# EAGLE schematic csa_copro-v1.0b (EAGLE 4.15)
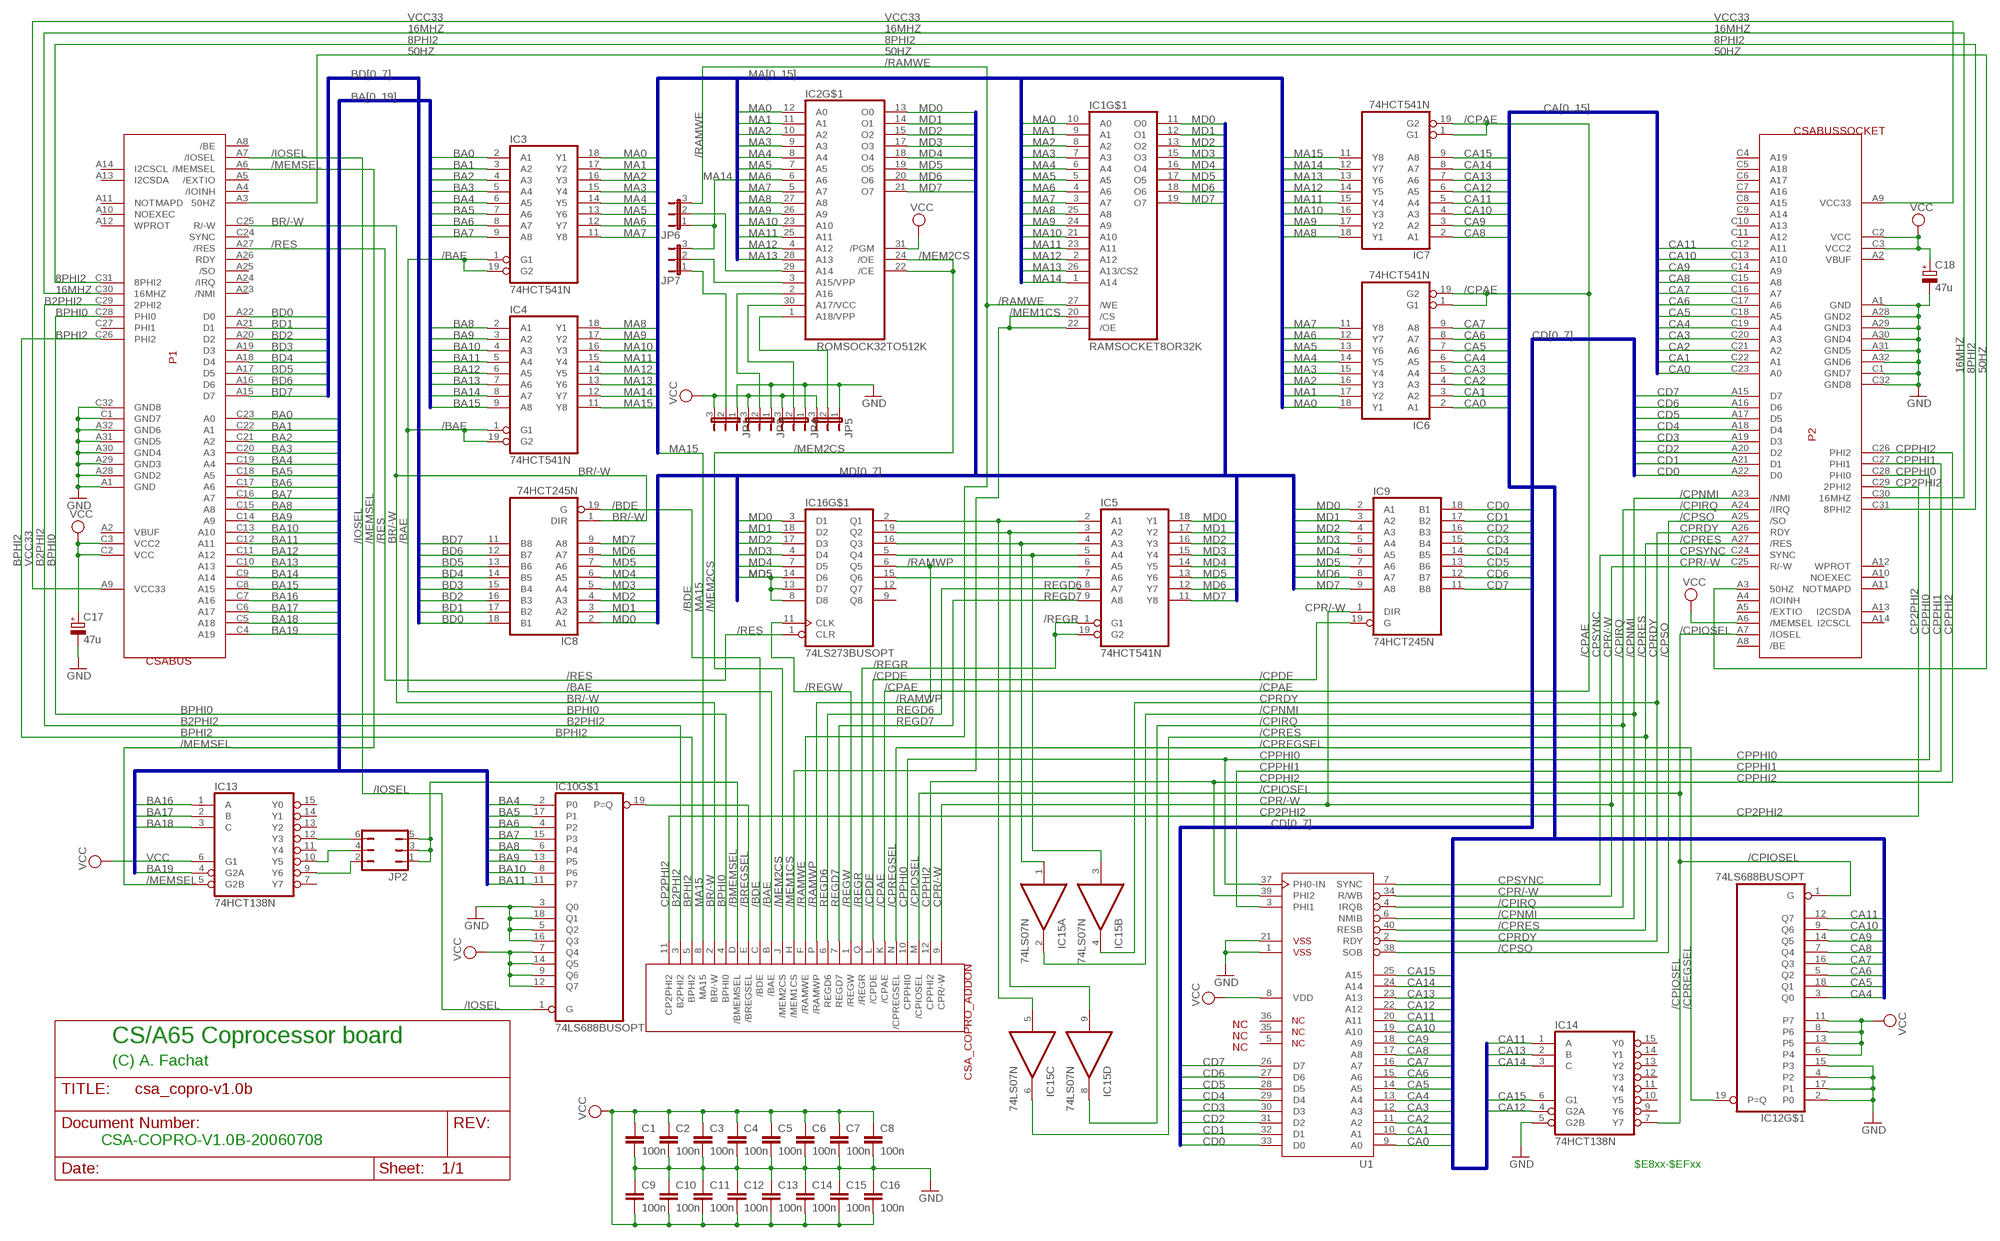
[diagram p0: schematic, sheet 1]

## Parts
C1  100n  C-EU025-025X050  [C025-025X050]
C2  100n  C-EU025-025X050  [C025-025X050]
C3  100n  C-EU025-025X050  [C025-025X050]
C4  100n  C-EU025-025X050  [C025-025X050]
C5  100n  C-EU025-025X050  [C025-025X050]
C6  100n  C-EU025-025X050  [C025-025X050]
C7  100n  C-EU025-025X050  [C025-025X050]
C8  100n  C-EU025-025X050  [C025-025X050]
C9  100n  C-EU025-025X050  [C025-025X050]
C10  100n  C-EU025-025X050  [C025-025X050]
C11  100n  C-EU025-025X050  [C025-025X050]
C12  100n  C-EU025-025X050  [C025-025X050]
C13  100n  C-EU025-025X050  [C025-025X050]
C14  100n  C-EU025-025X050  [C025-025X050]
C15  100n  C-EU025-025X050  [C025-025X050]
C16  100n  C-EU025-025X050  [C025-025X050]
C17  47u  CPOL-EUE2.5-5  [E2,5-5]
C18  47u  CPOL-EUE2.5-5  [E2,5-5]
IC1  RAMSOCKET8OR32K  [DIL28]
IC2  ROMSOCK32TO512K  [DIL32OPT28]
IC3  74HCT541N  [DIL20]
IC4  74HCT541N  [DIL20]
IC5  74HCT541N  [DIL20]
IC6  74HCT541N  [DIL20]
IC7  74HCT541N  [DIL20]
IC8  74HCT245N  [DIL20]
IC9  74HCT245N  [DIL20]
IC10  74LS688BUSOPT  [DIL20]
IC12  74LS688BUSOPT  [DIL20]
IC13  74HCT138N  [DIL16]
IC14  74HCT138N  [DIL16]
IC15  74LS07N  [DIL14]
IC16  74LS273BUSOPT  [DIL20]
JP1  JP2E  [JP2]
JP2  JP3Q  [JP3Q]
JP3  JP2E  [JP2]
JP4  JP2E  [JP2]
JP5  JP2E  [JP2]
JP6  JP2E  [JP2]
JP7  JP2E  [JP2]
P1  CSABUS  [CSABUS]
P2  CSABUSSOCKET  [CSABUSSOCK]
P3  CSA_COPRO_ADDON  [FLAT28]
U1  G65SC02P  [DIP-40]

## Nets
8PHI2: P1.C31(8PHI2) P2.C31(8PHI2)
16MHZ: P1.C30(16MHZ) P2.C30(16MHZ)
50HZ: P1.A3(50HZ) P2.A3(50HZ)
/BAE: IC3.1(G1) IC3.19(G2) IC4.1(G1) IC4.19(G2) P3.B(/BAE)
/BDE: IC8.19(G) P3.C(/BDE)
/BMEMSEL: JP2.1 JP2.3 JP2.5 P3.D(/BMEMSEL)
/BREGSEL: IC10.19(P=Q) P3.E(/BREGSEL)
/CPAE: IC6.1(G1) IC6.19(G2) IC7.1(G1) IC7.19(G2) P3.K(/CPAE)
/CPDE: IC9.19(G) P3.L(/CPDE)
/CPIOSEL: IC12.1(G) IC14.7(Y7) P2.A7(/IOSEL) P3.M(/CPIOSEL)
/CPIRQ: IC15.8(D:O) P2.A24(/IRQ) U1.4(IRQB)
/CPNMI: IC15.2(A:O) P2.A23(/NMI) U1.6(NMIB)
/CPREGSEL: IC12.19(P=Q) P3.N(/CPREGSEL)
/CPRES: IC15.6(C:O) P2.A27(/RES) U1.40(RESB)
/CPSO: P2.A25(/SO) U1.38(SOB)
/IOSEL: IC10.1(G) P1.A7(/IOSEL)
/MEM1CS: IC1.20(/CS) IC1.22(/OE) P3.H(/MEM1CS)
/MEM2CS: IC2.22(/CE) IC2.24(/OE) P3.J(/MEM2CS)
/MEMSEL: IC13.5(G2B) P1.A6(/MEMSEL)
/RAMWE: IC1.27(/WE) JP6.3 P3.F(/RAMWE)
/RAMWP: IC5.6(A5) IC16.6(Q5) P3.P(/RAMWP)
/REGR: IC5.1(G1) IC5.19(G2) P3.Q(/REGR)
/REGW: IC16.11(CLK) P3.1(/REGW)
/RES: IC16.1(CLR) P1.A27(/RES)
B2PHI2: P1.C29(2PHI2) P3.3(B2PHI2)
BA0: IC3.2(A1) P1.C23(A0)
BA1: IC3.3(A2) P1.C22(A1)
BA2: IC3.4(A3) P1.C21(A2)
BA3: IC3.5(A4) P1.C20(A3)
BA4: IC3.6(A5) IC10.2(P0) P1.C19(A4)
BA5: IC3.7(A6) IC10.17(P1) P1.C18(A5)
BA6: IC3.8(A7) IC10.4(P2) P1.C17(A6)
BA7: IC3.9(A8) IC10.15(P3) P1.C16(A7)
BA8: IC4.2(A1) IC10.6(P4) P1.C15(A8)
BA9: IC4.3(A2) IC10.13(P5) P1.C14(A9)
BA10: IC4.4(A3) IC10.8(P6) P1.C13(A10)
BA11: IC4.5(A4) IC10.11(P7) P1.C12(A11)
BA12: IC4.6(A5) P1.C11(A12)
BA13: IC4.7(A6) P1.C10(A13)
BA14: IC4.8(A7) P1.C9(A14)
BA15: IC4.9(A8) P1.C8(A15)
BA16: IC13.1(A) P1.C7(A16)
BA17: IC13.2(B) P1.C6(A17)
BA18: IC13.3(C) P1.C5(A18)
BA19: IC13.4(G2A) P1.C4(A19)
BD0: IC8.18(B1) P1.A22(D0)
BD1: IC8.17(B2) P1.A21(D1)
BD2: IC8.16(B3) P1.A20(D2)
BD3: IC8.15(B4) P1.A19(D3)
BD4: IC8.14(B5) P1.A18(D4)
BD5: IC8.13(B6) P1.A17(D5)
BD6: IC8.12(B7) P1.A16(D6)
BD7: IC8.11(B8) P1.A15(D7)
BPHI0: P1.C28(PHI0) P3.4(BPHI0)
BPHI2: P1.C26(PHI2) P3.5(BPHI2)
BR/-W: IC8.1(DIR) P1.C25(R/-W) P3.2(BR/-W)
CA0: IC6.2(A1) P2.C23(A0) U1.9(A0)
CA1: IC6.3(A2) P2.C22(A1) U1.10(A1)
CA2: IC6.4(A3) P2.C21(A2) U1.11(A2)
CA3: IC6.5(A4) P2.C20(A3) U1.12(A3)
CA4: IC6.6(A5) IC12.3(Q0) P2.C19(A4) U1.13(A4)
CA5: IC6.7(A6) IC12.18(Q1) P2.C18(A5) U1.14(A5)
CA6: IC6.8(A7) IC12.5(Q2) P2.C17(A6) U1.15(A6)
CA7: IC6.9(A8) IC12.16(Q3) P2.C16(A7) U1.16(A7)
CA8: IC7.2(A1) IC12.7(Q4) P2.C15(A8) U1.17(A8)
CA9: IC7.3(A2) IC12.14(Q5) P2.C14(A9) U1.18(A9)
CA10: IC7.4(A3) IC12.9(Q6) P2.C13(A10) U1.19(A10)
CA11: IC7.5(A4) IC12.12(Q7) IC14.1(A) P2.C12(A11) U1.20(A11)
CA12: IC7.6(A5) IC14.4(G2A) U1.22(A12)
CA13: IC7.7(A6) IC14.2(B) U1.23(A13)
CA14: IC7.8(A7) IC14.3(C) U1.24(A14)
CA15: IC7.9(A8) IC14.6(G1) U1.25(A15)
CD0: IC9.18(B1) P2.A22(D0) U1.33(D0)
CD1: IC9.17(B2) P2.A21(D1) U1.32(D1)
CD2: IC9.16(B3) P2.A20(D2) U1.31(D2)
CD3: IC9.15(B4) P2.A19(D3) U1.30(D3)
CD4: IC9.14(B5) P2.A18(D4) U1.29(D4)
CD5: IC9.13(B6) P2.A17(D5) U1.28(D5)
CD6: IC9.12(B7) P2.A16(D6) U1.27(D6)
CD7: IC9.11(B8) P2.A15(D7) U1.26(D7)
CP2PHI2: P2.C29(2PHI2) P3.11(CP2PHI2)
CPPHI0: P2.C28(PHI0) P3.10(CPPHI0) U1.37(PH0-IN)
CPPHI1: P2.C27(PHI1) U1.3(PHI1)
CPPHI2: P2.C26(PHI2) P3.12(CPPHI2) U1.39(PHI2)
CPR/-W: IC9.1(DIR) P2.C25(R/-W) P3.9(CPR/-W) U1.34(R/WB)
CPRDY: IC15.4(B:O) P2.A26(RDY) U1.2(RDY)
CPSYNC: P2.C24(SYNC) U1.7(SYNC)
GND: C1.2 C2.2 C3.2 C4.2 C5.2 C6.2 C7.2 C8.2 C9.1 C10.1 C11.1 C12.1 C13.1 C14.1 C15.1 C16.1 C17.- C18.- IC10.3(Q0) IC10.5(Q2) IC10.16(Q3) IC10.18(Q1) IC12.2(P0) IC12.4(P2) IC12.15(P3) IC12.17(P1) IC14.5(G2B) JP1.1 JP3.1 JP4.1 JP5.1 P1.A1(GND) P1.A28(GND2) P1.A29(GND3) P1.A30(GND4) P1.A31(GND5) P1.A32(GND6) P1.C1(GND7) P1.C32(GND8) P2.A1(GND) P2.A28(GND2) P2.A29(GND3) P2.A30(GND4) P2.A31(GND5) P2.A32(GND6) P2.C1(GND7) P2.C32(GND8) U1.1(VSS$1) U1.21(VSS$2)
MA0: IC1.10(A0) IC2.12(A0) IC3.18(Y1) IC6.18(Y1)
MA1: IC1.9(A1) IC2.11(A1) IC3.17(Y2) IC6.17(Y2)
MA2: IC1.8(A2) IC2.10(A2) IC3.16(Y3) IC6.16(Y3)
MA3: IC1.7(A3) IC2.9(A3) IC3.15(Y4) IC6.15(Y4)
MA4: IC1.6(A4) IC2.8(A4) IC3.14(Y5) IC6.14(Y5)
MA5: IC1.5(A5) IC2.7(A5) IC3.13(Y6) IC6.13(Y6)
MA6: IC1.4(A6) IC2.6(A6) IC3.12(Y7) IC6.12(Y7)
MA7: IC1.3(A7) IC2.5(A7) IC3.11(Y8) IC6.11(Y8)
MA8: IC1.25(A8) IC2.27(A8) IC4.18(Y1) IC7.18(Y1)
MA9: IC1.24(A9) IC2.26(A9) IC4.17(Y2) IC7.17(Y2)
MA10: IC1.21(A10) IC2.23(A10) IC4.16(Y3) IC7.16(Y3)
MA11: IC1.23(A11) IC2.25(A11) IC4.15(Y4) IC7.15(Y4)
MA12: IC1.2(A12) IC2.4(A12) IC4.14(Y5) IC7.14(Y5)
MA13: IC1.26(A13/CS2) IC2.28(A13) IC4.13(Y6) IC7.13(Y6)
MA14: IC1.1(A14) IC4.12(Y7) IC7.12(Y7) JP6.1 JP7.3
MA15: IC4.11(Y8) IC7.11(Y8) P3.8(MA15)
MD0: IC1.11(O0) IC2.13(O0) IC5.18(Y1) IC8.2(A1) IC9.2(A1) IC16.3(D1)
MD1: IC1.12(O1) IC2.14(O1) IC5.17(Y2) IC8.3(A2) IC9.3(A2) IC16.18(D2)
MD2: IC1.13(O2) IC2.15(O2) IC5.16(Y3) IC8.4(A3) IC9.4(A3) IC16.17(D3)
MD3: IC1.15(O3) IC2.17(O3) IC5.15(Y4) IC8.5(A4) IC9.5(A4) IC16.4(D4)
MD4: IC1.16(O4) IC2.18(O4) IC5.14(Y5) IC8.6(A5) IC9.6(A5) IC16.7(D5)
MD5: IC1.17(O5) IC2.19(O5) IC5.13(Y6) IC8.7(A6) IC9.7(A6) IC16.8(D8) IC16.13(D7) IC16.14(D6)
MD6: IC1.18(O6) IC2.20(O6) IC5.12(Y7) IC8.8(A7) IC9.8(A7)
MD7: IC1.19(O7) IC2.21(O7) IC5.11(Y8) IC8.9(A8) IC9.9(A8)
N$1: IC5.2(A1) IC15.5(C:I) IC16.2(Q1)
N$2: IC5.3(A2) IC15.9(D:I) IC16.19(Q2)
N$3: IC5.4(A3) IC15.1(A:I) IC16.16(Q3)
N$4: IC5.5(A4) IC15.3(B:I) IC16.5(Q4)
N$5: IC2.29(A14) JP6.2
N$6: IC5.7(A6) IC16.15(Q6)
N$7: IC2.3(A15/VPP) JP7.2
N$22: IC13.12(Y3) JP2.6
N$23: IC13.10(Y5) JP2.4
N$24: IC13.9(Y6) JP2.2
N$25: JP1.2 JP7.1
N$38: IC2.2(A16) JP3.2
N$39: IC2.30(A17/VCC) JP4.2
N$40: IC2.1(A18/VPP) JP5.2
REGD6: IC5.8(A7) P3.6(REGD6)
REGD7: IC5.9(A8) P3.7(REGD7)
VCC: C1.1 C2.1 C3.1 C4.1 C5.1 C6.1 C7.1 C8.1 C9.2 C10.2 C11.2 C12.2 C13.2 C14.2 C15.2 C16.2 C17.+ C18.+ IC2.31(/PGM) IC10.7(Q4) IC10.9(Q6) IC10.12(Q7) IC10.14(Q5) IC12.6(P4) IC12.8(P6) IC12.11(P7) IC12.13(P5) IC13.6(G1) JP1.3 JP3.3 JP4.3 JP5.3 P1.C2(VCC) P1.C3(VCC2) P2.A6(/MEMSEL) P2.C2(VCC) P2.C3(VCC2) U1.8(VDD)
VCC33: P1.A9(VCC33) P2.A9(VCC33)
Unconnected: IC13.7(Y7) IC13.11(Y4) IC13.13(Y2) IC13.14(Y1) IC13.15(Y0) IC14.9(Y6) IC14.10(Y5) IC14.11(Y4) IC14.12(Y3) IC14.13(Y2) IC14.14(Y1) IC14.15(Y0) IC15.10(E:O) IC15.11(E:I) IC15.12(F:O) IC15.13(F:I) IC16.9(Q8) IC16.12(Q7) P1.A2(VBUF) P1.A4(/IOINH) P1.A5(/EXTIO) P1.A8(/BE) P1.A10(NOEXEC) P1.A11(NOTMAPD) P1.A12(WPROT) P1.A13(I2CSDA) P1.A14(I2CSCL) P1.A23(/NMI) P1.A24(/IRQ) P1.A25(/SO) P1.A26(RDY) P1.C24(SYNC) P1.C27(PHI1) P2.A2(VBUF) P2.A4(/IOINH) P2.A5(/EXTIO) P2.A8(/BE) P2.A10(NOEXEC) P2.A11(NOTMAPD) P2.A12(WPROT) P2.A13(I2CSDA) P2.A14(I2CSCL) P2.C4(A19) P2.C5(A18) P2.C6(A17) P2.C7(A16) P2.C8(A15) P2.C9(A14) P2.C10(A13) P2.C11(A12) U1.5(NC$1) U1.35(NC$2) U1.36(NC$3)

## Buses
BA[0..19]
CA[0..15]
BD[0..7]
CD[0..7]
MA[0..15]
MD[0..7]

## Notes on the sheet
- CS/A65 Coprocessor board
- (C) A. Fachat
- CSA-COPRO-V1.0B-20060708
- $E8xx-$EFxx

## Power pins joined to a net without a drawn wire
GND: IC1.14(GND) IC2.16(GND) IC3.10(GND) IC4.10(GND) IC5.10(GND) IC6.10(GND) IC7.10(GND) IC8.10(GND) IC9.10(GND) IC10.10(GND) IC12.10(GND) IC13.8(GND) IC14.8(GND) IC15.7(P:GND) IC16.10(GND) P3.14(GND)
VCC: IC1.28(VCC) IC2.32(VCC) IC3.20(VCC) IC4.20(VCC) IC5.20(VCC) IC6.20(VCC) IC7.20(VCC) IC8.20(VCC) IC9.20(VCC) IC10.20(VCC) IC12.20(VCC) IC13.16(VCC) IC14.16(VCC) IC15.14(P:VCC) IC16.20(VCC) P3.A(VCC)

## Library data of the parts
C1-C16 = rcl:C-EU: CAPACITOR, European symbol
C17 C18 = rcl:CPOL-EU: POLARIZED CAPACITOR, European symbol
IC1 = csa:RAMSOCKET8OR32K
IC2 = csa:ROMSOCK32TO512K
IC3-IC7 = 74xx-eu:74*541: Octal BUFFER and LINE DRIVER, 3-state
IC8 IC9 = 74xx-eu:74*245: Octal BUS TRANSCEIVER, 3-state
IC10 IC12 = csa:74LS688BUSOPT
IC13 IC14 = 74xx-eu:74*138: 3-line to 8-line DECODER/DEMULTIPLEXER
IC15 = 74xx-eu:74*07: Hex BUFFER, open collector high-voltage output
IC16 = csa:74LS273BUSOPT
JP1 JP3-JP7 = jumper:JP2E: JUMPER
JP2 = jumper:JP3Q: JUMPER
P1 P2 = csa:CSABUS
P3 = csa:CSA_COPRO_ADDON
U1 = 65xxx:G65SC02P: California Micro Devices Version